# EAGLE design Mando (EAGLE 6.3)
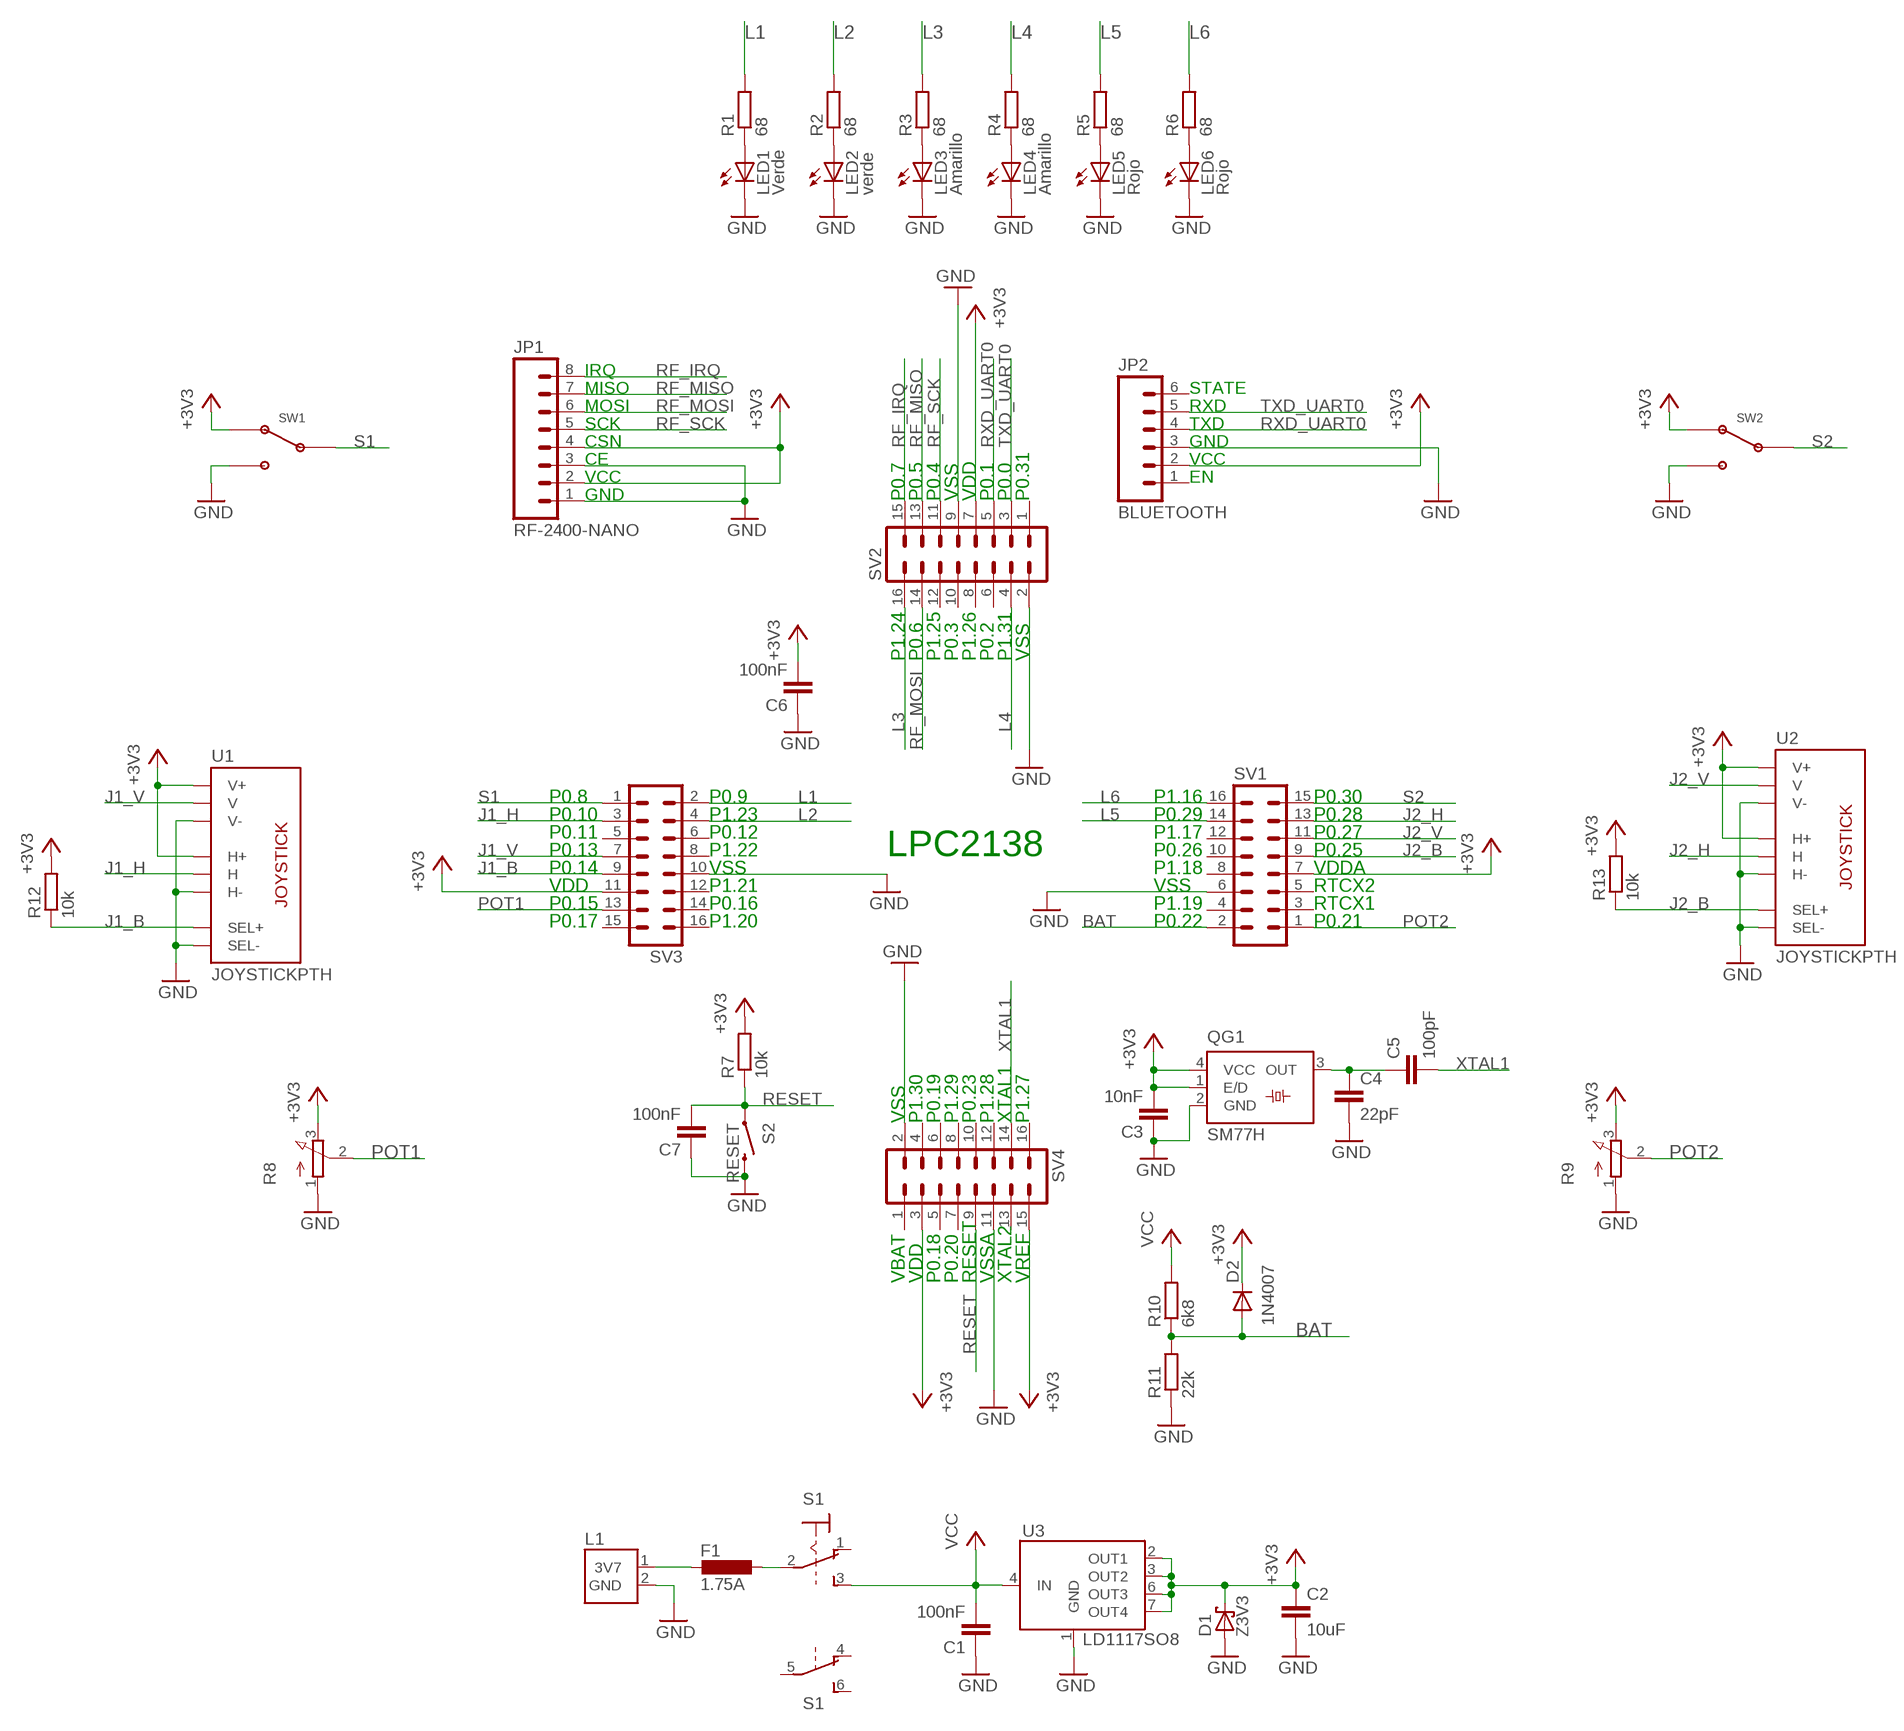
[diagram p0: schematic, sheet 1]

## Parts
C1  100nF  C-EUC0805  [C0805]
C2  10uF  C-EUC1206  [C1206]
C3  10nF  C-EUC0805  [C0805]
C4  22pF  C-EUC0805  [C0805]
C5  100pF  C-EUC0805  [C0805]
C6  100nF  C-EUC0805  [C0805]
C7  100nF  C-EUC0805  [C0805]
D1  Z3V3  SCHOTTKY-DIODEDO35-7  [DO35-7]
D2  1N4007  DIODE-SOD106-R  [SOD106-R]
F1  1.75A  L-EUL1812  [L1812]
JP1  RF-2400-NANO  M081X08  [1X08]
JP2  BLUETOOTH  M06SIP  [1X06]
L1  CONECTOR_LIPO_3.7V  [CONECTOR_LIPO_3.7V]
LED1  Verde  LED3MM  [LED3MM]
LED2  verde  LED3MM  [LED3MM]
LED3  Amarillo  LED3MM  [LED3MM]
LED4  Amarillo  LED3MM  [LED3MM]
LED5  Rojo  LED3MM  [LED3MM]
LED6  Rojo  LED3MM  [LED3MM]
QG1  SM77H  [SM77H]
R1  68  R-EU_M0805  [M0805]
R2  68  R-EU_M0805  [M0805]
R3  68  R-EU_M0805  [M0805]
R4  68  R-EU_M0805  [M0805]
R5  68  R-EU_M0805  [M0805]
R6  68  R-EU_M0805  [M0805]
R7  10k  R-EU_M0805  [M0805]
R8  3RP/1610N  [3RP/1610N]
R9  3RP/1610N  [3RP/1610N]
R10  6k8  R-EU_M0805  [M0805]
R11  22k  R-EU_M0805  [M0805]
R12  10k  R-EU_M0805  [M0805]
R13  10k  R-EU_M0805  [M0805]
S1  SWITCH_2P2T_SL  [SLIDE_SWITCH_2P2T]
S2  RESET  SWITCH-MOMENTARY-2PTH  [TACTILE-PTH]
SV1  MA08-2  [MA08-2]
SV2  MA08-2  [MA08-2]
SV3  MA08-2  [MA08-2]
SV4  MA08-2  [MA08-2]
SW1  SW_1382_R/A  [SW_MX1382]
SW2  SW_1382_R/A  [SW_MX1382]
U1  JOYSTICKPTH  [JOYSTICK]
U2  JOYSTICKPTH  [JOYSTICK]
U3  LD1117SO8  [SO8]

## Nets
+3V3: C2.1 C3.2 C6.2 D1.C D2.C JP1.2 JP1.4 JP2.2 QG1.1(E/D) QG1.4(VCC) R7.2 R8.3(E) R9.3(E) R12.2 R13.2 SV1.7 SV2.7 SV3.11 SV4.3 SV4.15 SW1.N.C SW2.N.C U1.H1(H+) U1.V1(V+) U2.H1(H+) U2.V1(V+) U3.2(OUT1) U3.3(OUT2) U3.6(OUT3) U3.7(OUT4)
BAT: D2.A R10.1 R11.2 SV1.2
GND: C1.1 C2.2 C3.1 C4.2 C6.1 C7.1 D1.A JP1.1 JP1.3 JP2.3 L1.2(GND) LED1.K(C) LED2.K(C) LED3.K(C) LED4.K(C) LED5.K(C) LED6.K(C) QG1.2(GND) R8.1(A) R9.1(A) R11.1 S2.3 SV1.6 SV2.2 SV2.9 SV3.10 SV4.2 SV4.11 SW1.N.O SW2.N.O U1.B2A(SEL-) U1.H3(H-) U1.V3(V-) U2.B2A(SEL-) U2.H3(H-) U2.V3(V-) U3.1(GND)
J1_B: R12.1 SV3.9 U1.B1A(SEL+)
J1_H: SV3.3 U1.H2(H)
J1_V: SV3.7 U1.V2(V)
J2_B: R13.1 SV1.9 U2.B1A(SEL+)
J2_H: SV1.13 U2.H2(H)
J2_V: SV1.11 U2.V2(V)
L1: R1.2 SV3.2
L2: R2.2 SV3.4
L3: R3.2 SV2.16
L4: R4.2 SV2.4
L5: R5.2 SV1.14
L6: R6.2 SV1.16
N$1: F1.2 L1.1(3V7)
N$2: F1.1 S1.2(1:P)
N$4: LED1.A R1.1
N$5: C4.1 C5.1 QG1.3(OUT)
N$69: LED2.A R2.1
N$70: LED3.A R3.1
N$71: LED4.A R4.1
N$72: LED5.A R5.1
N$73: LED6.A R6.1
POT1: R8.2(S) SV3.13
POT2: R9.2(S) SV1.1
RESET: C7.2 R7.1 S2.1 SV4.9
RF_IRQ: JP1.8 SV2.15
RF_MISO: JP1.7 SV2.13
RF_MOSI: JP1.6 SV2.14
RF_SCK: JP1.5 SV2.11
RXD_UART0: JP2.4 SV2.5
S1: SV3.1 SW1.COM
S2: SV1.15 SW2.COM
TXD_UART0: JP2.5 SV2.3
VCC: C1.2 R10.2 S1.3(1:S) U3.4(IN)
XTAL1: C5.2 SV4.14
Unconnected: JP2.1 JP2.6 S1.1(1:O) S1.4(2:O) S1.5(2:P) S1.6(2:S) SV1.3 SV1.4 SV1.5 SV1.8 SV1.10 SV1.12 SV2.1 SV2.6 SV2.8 SV2.10 SV2.12 SV3.5 SV3.6 SV3.8 SV3.12 SV3.14 SV3.15 SV3.16 SV4.1 SV4.4 SV4.5 SV4.6 SV4.7 SV4.8 SV4.10 SV4.12 SV4.13 SV4.16

## Notes on the sheet
- IRQ
- MISO | STATE
- MOSI | RXD
- SCK | TXD
- CSN | GND
- CE | VCC
- VCC | EN
- GND | P0.7 | P0.5 | P0.4 | VSS | VDD | P0.1 | P0.0 | P0.31
- P1.24 | P0.6 | P1.25 | P0.3 | P1.26 | P0.2 | P1.31 | VSS
- P0.8 | P0.9 | P1.16 | P0.30
- P0.10 | P1.23 | P0.29 | P0.28
- P0.11 | P0.12 | P1.17 | P0.27
- P0.13 | P1.22 | LPC2138 | P0.26 | P0.25
- P0.14 | VSS | P1.18 | VDDA
- VDD | P1.21 | VSS | RTCX2
- P0.15 | P0.16 | P1.19 | RTCX1
- P0.17 | P1.20 | P0.22 | P0.21
- VSS | P1.30 | P0.19 | P1.29 | P0.23 | P1.28 | XTAL1 | P1.27
- VBAT | VDD | P0.18 | P0.20 | RESET | VSSA | XTAL2 | VREF

## Library data of the parts
C1-C7 = resistor:C-EU: CAPACITOR, European symbol
D1 = diode:SCHOTTKY-DIODE: Schottky Diode
D2 = diode:DIODE-: DIODE
F1 = resistor:L-EU: INDUCTOR, European symbol
JP1 = SparkFun:M08: Header 8 Standard 8-pin 0.1" header. Use with straight break away headers (SKU : PRT-00116), right angle break away headers (PRT-00553), swiss pins (PRT-00743), machine pins (PRT-00117), and female headers (PRT-00115).
JP2 = SparkFun:M06: Header 6 Standard 6-pin 0.1" header. Use with straight break away headers (SKU : PRT-00116), right angle break away headers (PRT-00553), swiss pins (PRT-00743), machine pins (PRT-00117), and female headers (PRT-00115). Molex polarized connector foot print use with SKU : PRT-08094 with associated crimp pins and housings. NOTES ON THE VARIANTS LOCK and LOCK_LONGPADS... This footprint was designed to help hold the alignment of a through-hole component (i.e. 6-pin header) while soldering it into place. You may notice that each hole has been shifted either up or down by 0.005 of an inch from it's more standard position (which is a perfectly straight line). This slight alteration caused the pins (the squares in the middle) to touch the edges of the holes. Because they are alternating, it causes a "brace" to hold the component in place. 0.005 has proven to be the perfect amount of "off-center" position when using our standard breakaway headers. Although looks a little odd when you look at the bare footprint, once you have a header in there, the alteration is very hard to notice. Also, if you push a header all the way into place, it is covered up entirely on the bottom side. This idea of altering the position of holes to aid alignment will be further integrated into the Sparkfun Library for other footprints. It can help hold any component with 3 or more connection pins.
L1 = Robots:CONECTOR_LIPO_3.7V
LED1-LED6 = led:LED: LED OSRAM: - CHIPLED LG R971, LG N971, LY N971, LG Q971, LY Q971, LO R971, LY R971 LH N974, LH R974 LS Q976, LO Q976, LY Q976 LO Q996 - Hyper CHIPLED LW Q18S LB Q993, LB Q99A, LB R99A - SideLED LS A670, LO A670, LY A670, LG A670, LP A670 LB A673, LV A673, LT A673, LW A673 LH A674 LY A675 LS A676, LA A676, LO A676, LY A676, LW A676 LS A679, LY A679, LG A679 - Hyper Micro SIDELED® LS Y876, LA Y876, LO Y876, LY Y876 LT Y87S - SmartLED LW L88C, LW L88S LB L89C, LB L89S, LG L890 LS L89K, LO L89K, LY L89K LS L896, LA L896, LO L896, LY L896 - TOPLED LS T670, LO T670, LY T670, LG T670, LP T670 LSG T670, LSP T670, LSY T670, LOP T670, LYG T670 LG T671, LOG T671, LSG T671 LB T673, LV T673, LT T673, LW T673 LH T674 LS T676, LA T676, LO T676, LY T676, LB T676, LH T676, LSB T676, LW T676 LB T67C, LV T67C, LT T67C, LS T67K, LO T67K, LY T67K, LW E67C LS E67B, LA E67B, LO E67B, LY E67B, LB E67C, LV E67C, LT E67C LW T67C LS T679, LY T679, LG T679 LS T770, LO T770, LY T770, LG T770, LP T770 LB T773, LV T773, LT T773, LW T773 LH T774 LS E675, LA E675, LY E675, LS T675 LS T776, LA T776, LO T776, LY T776, LB T776 LHGB T686 LT T68C, LB T68C - Hyper Mini TOPLED® LB M676 - Mini TOPLED Santana® LG M470 LS M47K, LO M47K, LY M47K Source: http://www.osram.convergy.de LUXEON: - LUMILED® LXK2-PW12-R00, LXK2-PW12-S00, LXK2-PW14-U00, LXK2-PW14-V00 LXK2-PM12-R00, LXK2-PM12-S00, LXK2-PM14-U00 LXK2-PE12-Q00, LXK2-PE12-R00, LXK2-PE12-S00, LXK2-PE14-T00, LXK2-PE14-U00 LXK2-PB12-K00, LXK2-PB12-L00, LXK2-PB12-M00, LXK2-PB14-N00, LXK2-PB14-P00, LXK2-PB14-Q00 LXK2-PR12-L00, LXK2-PR12-M00, LXK2-PR14-Q00, LXK2-PR14-R00 LXK2-PD12-Q00, LXK2-PD12-R00, LXK2-PD12-S00 LXK2-PH12-R00, LXK2-PH12-S00 LXK2-PL12-P00, LXK2-PL12-Q00, LXK2-PL12-R00 Source: www.luxeon.com KINGBRIGHT: KA-3528ASYC Source: www.kingbright.com
QG1 = crystal:SM77H: 3.3V CMOS Clock Oscillator Source: www.pletronics.com .. sm77h%203.3v.pdf; OC_FARNELL: unknown; OC_NEWARK: unknown
R1-R7 R10-R13 = resistor:R-EU_: RESISTOR, European symbol
R8 R9 = Robots:3RP/1610N: 16mm Potentiometer one level Source: http://www.alphapotentiometers.net/html/16mm_pot_2.html
S1 = Robots:SWITCH_2P2T: TOGGLE SWITCH Marquardt
S2 = SparkFun:SWITCH-MOMENTARY-2
SV1-SV4 = con-lstb:MA08-2: PIN HEADER; OC_FARNELL: unknown; OC_NEWARK: unknown
SW1 SW2 = Robots:SW_1382
U1 U2 = SparkFun:JOYSTICK: Thumb Joystick Joystick commonly found in PS2 controllers. Two pots and a select switch. Footprint proven. Spark Fun Electronics SKU : COM-09032
U3 = Robots:LD1117SO8

## Board
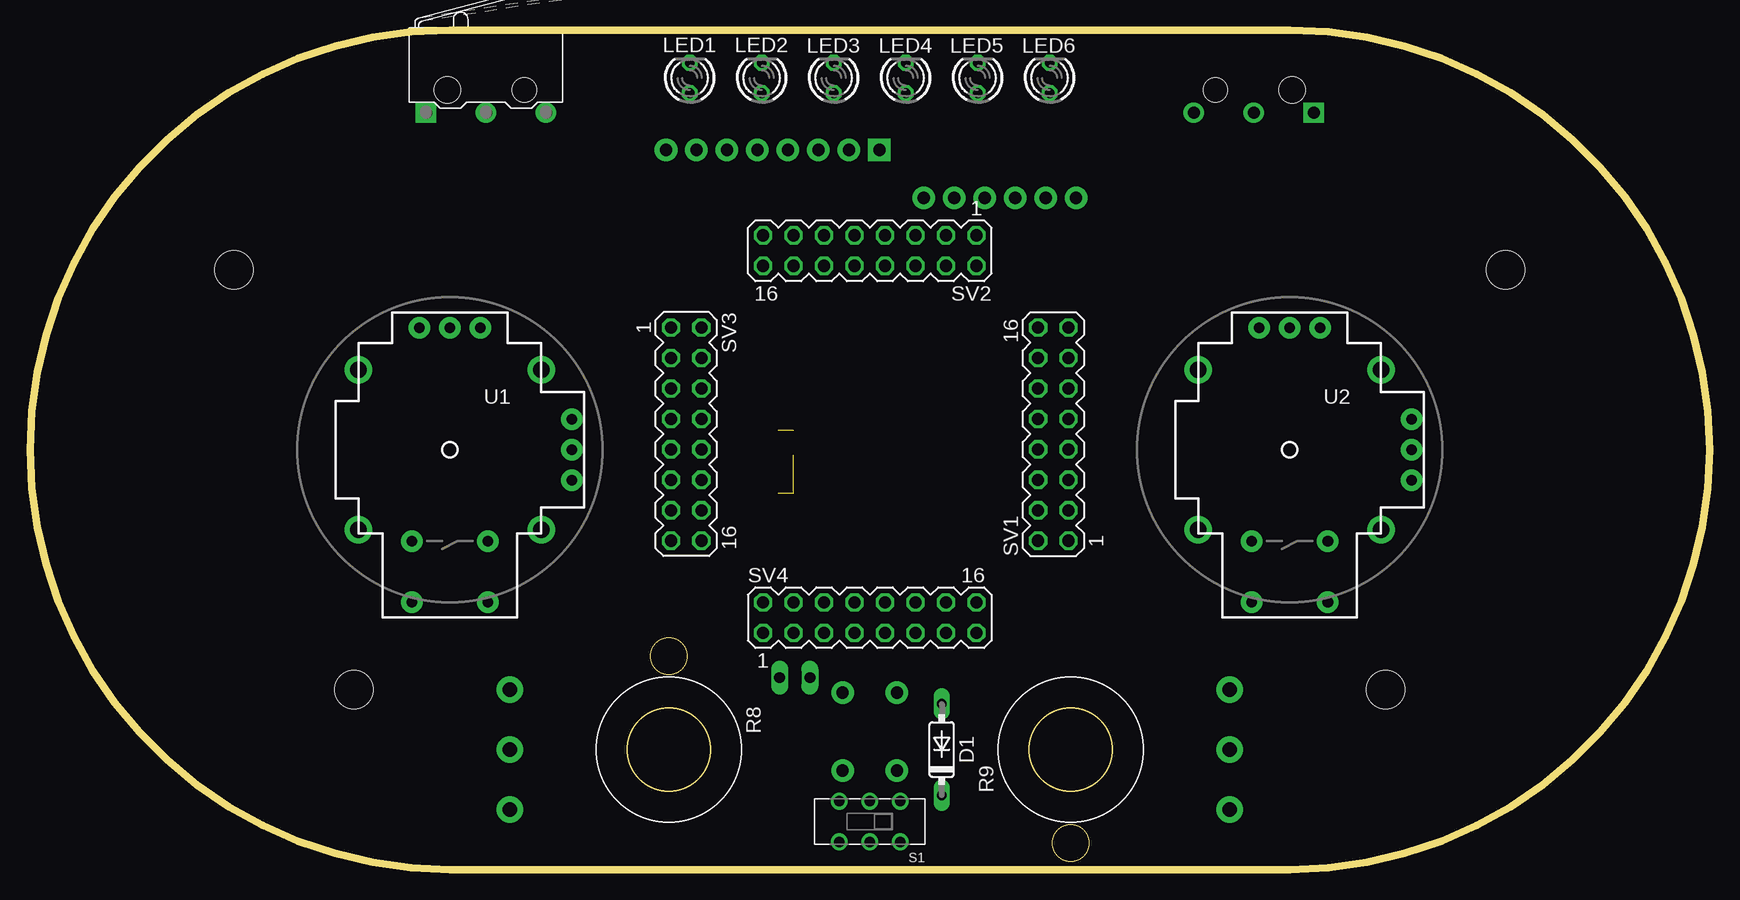
[diagram p1: board, top side]
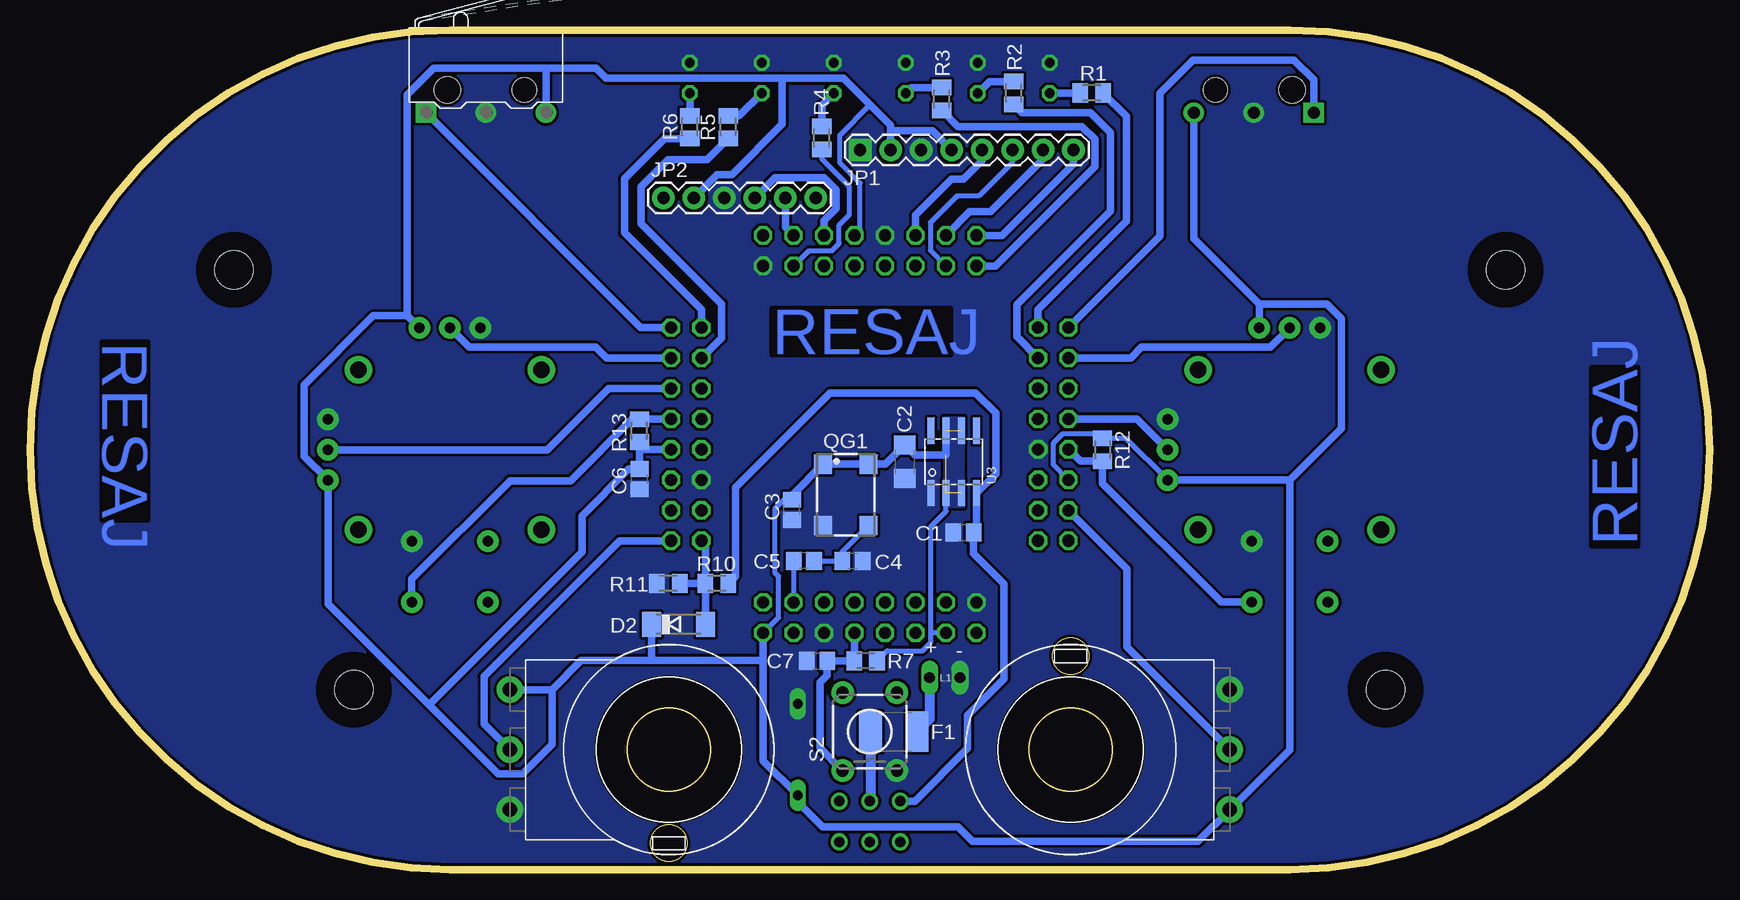
[diagram p2: board, bottom side, seen from below]

Size 140 x 70 mm. Coordinates in mm from the lower left corner, seen from the top.
Outline: 0,35 arc90 35,0 105,0 arc90 140,35 arc90 105,70 35,70 arc90 0,35
Copper layers (1*16): Top 0.035mm / dielectric 1.5mm / Bottom 0.035mm
Design rules "ITEADstudio_DRC *": minimum track width 6mil, minimum drill 12mil, track to track 9mil, track to pad 9mil, pad to pad 9mil, via to via 9mil, smd to smd 0mil, copper to edge 10mil, drill to drill 10mil, minimum pad ring 10mil, minimum via ring 6mil, stop-mask expansion 2mil, vias tented up to drill 100mil, thermal gap 10mil
Holes 3.2 mm at 27,15 17,50 113,15 123,50
bRestrict: area 47.2,4 to 59.3,16.1; area 80.7,4 to 92.8,16.1; area 14,47 to 20,53; area 24,12 to 30,18; area 110,12 to 116,18; area 120,47 to 126,53

### Footprints (pad centres in the part's own frame; a part is rotated, then mirrored left to right if it is on the bottom)
C0805 = smd 1.3 x 1.5: 1 -0.85,0; 2 0.85,0
C1206 = smd 1.6 x 1.8: 1 -1.4,0; 2 1.4,0
DO35-7 = drill 0.813 long: A 3.81,0; C -3.81,0
SOD106-R = smd 1.6 x 2.1: A 2.25,0; C -2.25,0
L1812 = smd 1.9 x 3.4: 1 -1.95,0; 2 1.95,0
1X08 = drill 1.016 pad 1.88 square: 1 0,0 | drill 1.016 pad 1.88: 2 2.54,0; 3 5.08,0; 4 7.62,0; 5 10.16,0; 6 12.7,0; 7 15.24,0; 8 17.78,0
1X06 = drill 1.016 pad 1.88: 1 0,0; 2 2.54,0; 3 5.08,0; 4 7.62,0; 5 10.16,0; 6 12.7,0
CONECTOR_LIPO_3.7V = drill 0.9 long: 1 1.27,0; 2 -1.27,0
LED3MM = drill 0.813 octagon: A -1.27,0; K 1.27,0
SM77H = smd 1.6 x 1.5: 1 -2.55,-1.9; 2 2.55,-1.9; 3 2.55,1.9; 4 -2.55,1.9
M0805 = smd 1.3 x 1.6: 1 -0.95,0; 2 0.95,0
3RP/1610N = drill 1.2 pad 2.184: 1 -5,0; 2 0,0; 3 5,0
SLIDE_SWITCH_2P2T = drill 0.9: 1 -2.54,-1.7; 2 0,-1.7; 3 2.54,-1.7; 4 -2.54,1.7; 5 0,1.7; 6 2.54,1.7
TACTILE-PTH = drill 1.016 pad 1.88: 1 -3.251,2.261; 2 3.251,2.261; 3 -3.251,-2.261; 4 3.251,-2.261
MA08-2 = drill 1.016 octagon: 1 -8.89,-1.27; 2 -8.89,1.27; 3 -6.35,-1.27; 4 -6.35,1.27; 5 -3.81,-1.27; 6 -3.81,1.27; 7 -1.27,-1.27; 8 -1.27,1.27; 9 1.27,-1.27; 10 1.27,1.27; 11 3.81,-1.27; 12 3.81,1.27; 13 6.35,-1.27; 14 6.35,1.27; 15 8.89,-1.27; 16 8.89,1.27
SW_MX1382 = drill 1 pad 1.676 square: COM -5,-3.9 | drill 1 pad 1.676: N.C 5,-3.9; N.O 0,-3.9 | hole 2: 3.2,-2 | hole 2.2: -3.2,-2
JOYSTICK = drill 0.9 pad 1.778: B1A -3.175,12.7; B1B 3.175,12.7; B2A -3.175,7.62; B2B 3.175,7.62 | drill 0.889 pad 1.778: H1 -2.54,-10.16; H2 0,-10.16; H3 2.54,-10.16; V1 -10.16,2.54; V2 -10.16,0; V3 -10.16,-2.54 | drill 1.397 pad 2.286: MOUNT1 -7.62,6.668; MOUNT2 -7.62,-6.668; MOUNT3 7.62,-6.668; MOUNT4 7.62,6.668
SO8 = smd 0.6 x 2.2: 1 -1.905,-2.6; 2 -0.635,-2.6; 3 0.635,-2.6; 4 1.905,-2.6; 5 1.905,2.6; 6 0.635,2.6; 7 -0.635,2.6; 8 -1.905,2.6

### Placement (x,y rotation side)
C1  62.2,28.1 0 bottom
C2  67.1,34 270 bottom
C3  76.5,30 90 bottom
C4  71.45,25.75 0 bottom
C5  75.5,25.75 180 bottom
C6  89.2,32.55 90 bottom
C7  74.4,17.4 0 bottom
D1  76,10 90 top
D2  85.95,20.45 0 bottom
F1  68,11.5 0 bottom
JP1  70.8,60 0 bottom
JP2  87.2,56 0 bottom
L1  63.75,16 180 bottom
LED1  55,66 90 top
LED2  61,66 90 top
LED3  67,66 90 top
LED4  73,66 90 top
LED5  79,66 90 top
LED6  85,66 90 top
QG1  72,31.25 270 bottom
R1  51.5,64.75 0 bottom
R2  58,64.75 270 bottom
R3  64,64.25 270 bottom
R4  74,61 270 bottom
R5  81.8,61.9 270 bottom
R6  85,61.9 270 bottom
R7  70.35,17.4 0 bottom
R8  40,10 270 top
R9  100,10 90 top
R10  82.75,23.85 0 bottom
R11  86.8,23.85 0 bottom
R12  50.6,35 90 bottom
R13  89.2,36.6 270 bottom
S1  70,4 180 top
S2  70,11.5 90 bottom
SV1  85.3,36.3 90 top
SV2  70,51.6 180 top
SV3  54.7,36.3 270 top
SV4  70,21 0 top
SW1  38,67 0 top
SW2  102,67 0 bottom
U1  35,35 180 top
U2  105,35 180 top
U3  63,34 0 bottom

### Tracks (layer width: path | path; a pad name or v marks a point on that pad's centre or on a via)
+3V3  (3 unrouted)
  Bottom 0.406: SV3.11 54.7,33.76 54.7,35.55 53.95,36.3 50.95,36.3 R12.2 48.65,35.95 U1.V1 | R7.2 68.55,18.25 65.6,18.25 64.9,18.95 64.9,19.75 | 64.9,19.75 64.9,28.6 63.63,29.86 U3.2 | SV4.3 64.88,19.73 64.9,19.75 | SV2.7 70.8,53.34 70.8,57.25 72.5,58.95 72.5,61.25 69.97,63.77 | SV4.15 77.6,21.02 77.6,24.45 77.9,24.75 77.9,30.1 77.15,30.85 C3.2
  Bottom 0.61: 97,66.8 92.8,66.8 92,66 77.3,66 | 97,66.8 106.35,66.8 108.55,64.6 108.55,46.17 | 108.55,46.17 U2.H1 | 108.55,46.17 111.38,46.17 117.15,40.4 117.15,34.45 U2.V1 115.16,22.16 106.75,13.75 | 68.26,61.6 64.78,61.6 JP1.4 | U1.H1 37.54,47.15 | 37.54,47.15 31.9,47.15 30.7,45.95 30.7,36.76 35,32.46 | 37.54,47.15 43,52.61 SW1.N.C | 96.5,15 96.5,10.45 98.95,8 101,8 106.75,13.75 | 96.5,15 R9.3 | 77.3,66 72.2,66 69.97,63.77 68.26,62.06 68.26,61.6 | SW2.N.C 97,66.8 | 68.26,61.6 JP1.2 | U1.V1 35,32.46 | 78.89,17.45 88.2,17.45 | 88.2,17.45 94.05,17.45 96.5,15 | 78.89,17.45 78.89,9.08 D1.C 76,5.6 73.95,3.55 62.65,3.55 61.45,2.35 42.65,2.35 R8.3 35,10 35,32.46 | D2.C 88.2,17.45 | U3.7 63.63,34.55 66.25,34.55 C2.1 68.7,33.8 QG1.4 QG1.1 76.5,31.2 C3.2 | 78.89,17.45 SV4.15 | JP2.2 82.71,57.95 81.5,57.95 77.3,62.15 77.3,66 | 106.75,13.75 94,26.5 94,29.5 90.1,33.4 C6.2 89.2,35.03 | SV1.7 89.2,35.03 | 89.2,35.03 R13.2
  pour Bottom (no thermals): 63.75,37.7 62.25,37.7 62.25,30.25 63.75,30.25
BAT
  Bottom 0.61: R11.2 R10.1 | R10.1 D2.A | R10.1 83.7,27.08 SV1.2
GND
  pour Bottom (rank 2, no thermals): 0,35 arc-90 35,70 70,70 105,70 arc-90 140,35 arc-90 105,0 70,0 35,0 arc-90
J1_B
  Bottom 0.61: U1.B1A 40.7,22.3 50.6,32.2 R12.1 52.45,34.05 SV3.9
J1_H
  Bottom 0.61: U1.H2 36.61,43.55 47.35,43.55 48.25,42.65 SV3.3
J1_V
  Bottom 0.61: U1.V2 47.73,37.57 SV3.7
J2_B
  Bottom 0.61: U2.B1A 108.17,24.23 100,32.4 94.95,32.4 89.8,37.55 R13.1 89.18,37.57 SV1.9
J2_H
  Bottom 0.61: U2.H2 103.39,43.55 92.85,43.55 91.95,42.65 SV1.13
J2_V
  Bottom 0.61: SV1.11 91.79,40.11 96.9,35 U2.V2
L1
  Bottom 0.61: R1.2 48.6,62.8 48.6,54.05 55.97,46.68 SV3.2
L2
  Bottom 0.61: SV3.4 57.75,44.43 57.75,47.1 49.95,54.9 49.95,61.45 51.6,63.1 57.3,63.1 R2.2
L3
  Bottom 0.61: R3.2 62.65,61.95 52.3,61.95 51.25,60.9 51.25,58.59 59.51,50.33 SV2.16
L4
  Bottom 0.406: SV2.4 75.08,51.6 73.15,51.6 72.55,52.2 72.55,53.75 71.7,54.6 71.7,56.95 74,59.25 R4.2
L5
  Bottom 0.61: SV1.14 82.35,44.33 82.35,47.15 89.05,53.85 89.05,56.95 86.8,59.2 83.55,59.2 R5.2
L6
  Bottom 0.61: R6.2 87.1,60.95 90.45,57.6 90.45,53.1 84.03,46.68 SV1.16
N$1
  Bottom 0.813: L1.1 65.02,12.53 F1.2
N$2
  Bottom 0.813: F1.1 69.95,5.75 S1.2
N$4
  Bottom 0.305: 52.47,64.73 R1.1
  Bottom 0.61: LED1.A 52.47,64.73
N$5
  Bottom 0.406: C5.1 C4.1 72.3,26.5 QG1.3
N$69
  Bottom 0.61: R2.1 60.03,65.7 LED2.A
N$70
  Bottom 0.61: R3.1 66.53,65.2 LED3.A
N$71
  Bottom 0.61: LED4.A 74,63.73 R4.1
N$72
  Bottom 0.61: LED5.A 80.88,62.85 R5.1
N$73
  Bottom 0.61: LED6.A R6.1
POT1
  Bottom 0.61: R8.2 48.55,18.55 48.55,25.07 SV3.13
POT2
  Bottom 0.61: R9.2 102.15,12.15 102.15,16.1 90.84,27.41 SV1.1
RESET
  Bottom 0.61: SV4.9 71.27,17.43 R7.1 C7.2 73.55,16.2 74.15,15.6 74.15,10.14 S2.1
RF_IRQ
  Bottom 0.61: JP1.8 53.02,58.83 58.98,52.87 SV2.15
RF_MISO
  Bottom 0.61: JP1.7 55.56,59.24 59.95,54.85 61.67,54.85 SV2.13
RF_MOSI
  Bottom 0.406: SV2.14 64.95,51.63 64.95,53.95 62.75,56.15 60.9,56.15 58.1,58.95 JP1.6
RF_SCK
  Bottom 0.61: JP1.5 60.64,59.11 62.2,57.55 63.2,57.55 66.19,54.56 SV2.11
RXD_UART0
  Bottom 0.61: SV2.5 73.81,54.09 72.8,55.1 72.8,56.7 73.8,57.7 77.88,57.7 JP2.4
S1
  Bottom 0.61: SW1.COM 33,65.85 34.65,67.5 43.05,67.5 45.8,64.75 45.8,52.82 SV3.1
S2
  Bottom 0.61: SV1.15 89.09,45.19 SW2.COM
TXD_UART0
  Bottom 0.61: JP2.5 77.04,53.56 SV2.3
VCC
  Bottom 0.61: R10.2 81.2,24.45 81.2,31.85 73.3,39.75 61.2,39.75 59.5,38.05 59.5,32.99 U3.4 61.09,28.36 C1.2 61.35,26.35 58.8,23.8 58.8,15.9 61.85,12.85 61.85,10.1 66.25,5.7 S1.3
XTAL1
  Bottom 0.406: C5.2 SV4.14

### Text on the board
Bottom: RESAJ | RESAJ | RESAJ